# EasyEDA Pro project xxxChamp.epro

# Schematic Schematic1
Board Name: Board1; Create Date: 2025-12-23; Page Name: P1; Project Name: New Project_2025-12-23_15-30-17; Schematic Name: Schematic1; Update Date: 2025-12-23; Company: EasyEDA.com; Page Size: A4; Version: V1.0
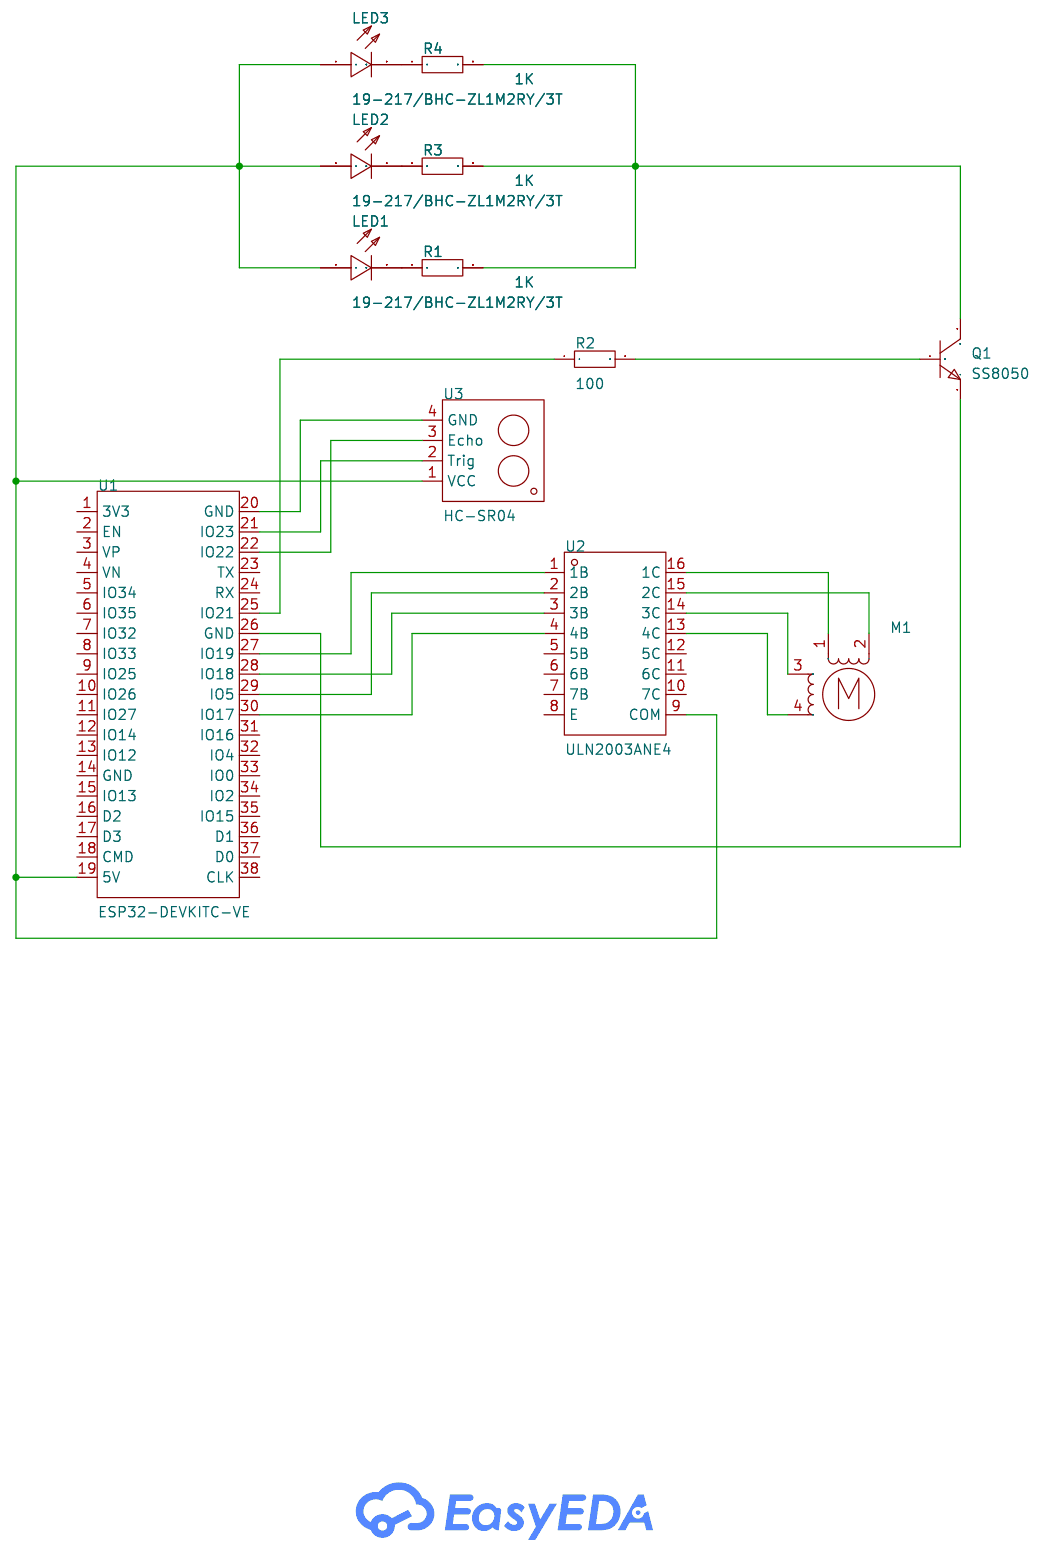
[diagram p0: schematic sheet]

## Parts
LED1  19-217/BHC-ZL1M2RY/3T
LED2  19-217/BHC-ZL1M2RY/3T
LED3  19-217/BHC-ZL1M2RY/3T
M1  Stepper_Motor_bipolar
Q1  SS8050  [SOT-23-3_L2.9-W1.3-P1.90-LS2.4-BR]
R1  1K  [R0603]
R2  100  [R0603]
R3  1K  [R0603]
R4  1K  [R0603]
U1  ESP32-DEVKITC-VE  [BULETM-SMD_ESP32-DEVKITC]
U2  ULN2003ANE4  [PDIP-16_L19.3-W6.4-P2.54-LS7.9-BL]
U3  HC-SR04

## Library data of the parts
LED1-LED3 = LED: Supplier: LCSC; Manufacturer: EVERLIGHT; Supplier Part: C72041; JLCPCB Part Class: Basic Part
M1 = Stepper_Motor_bipolar: User doc link: http://www.infineon.com/dgdl/Application-Note-TLE8110EE_driving_UniPolarStepperMotor_V1.1.pdf?fileId=db3a30431be39b97011be5d0aa0a00b0
Q1 = Transistor SS8050: Transistor Type: Collector-Emitter Breakdown Voltage (Vceo): Collector Current (Ic): Power Dissipation (Pd): Collector Cut-Off Current (Icbo):100nA Collector-Emitter Saturation Voltage (VCE(sat)@Ic,Ib):500mV@800mA,80mA DC Current Gain (hFE@Ic,Vce):200@100; Collector Cut-Off Current (Icbo): 100nA; Collector-Emitter Saturation Voltage (VCE(sat)@Ic,Ib): 500mV@800mA,80mA; Datasheet: https://atta.szlcsc.com/upload/public/pdf/source/20140809/1457707209319.pdf; DC Current Gain (hFE@Ic,Vce): 200@100mA,1V; JLCPCB Part Class: Basic Part; LCSC Part Name: NPN 25V 1.5A; Manufacturer: CJ(江苏长电/长晶); Operating Temperature: +150℃@(Tj); Supplier: LCSC; Supplier Footprint: SOT-23-3; Supplier Part: C2150; Transition Frequency (fT): 100MHz
R1-R4 = Res_0603: Supplier Footprint: 0603
U1 = ESP32-DEVKITC-VE: Supplier Part: C20437001; Manufacturer: ESPRESSIF(乐鑫); JLCPCB Part Class: Extended Part; Datasheet: https://item.szlcsc.com/datasheet/ESP32-DEVKITC-VE/21775466.html; Supplier: LCSC
U2 = ULN2003ANE4: Supplier Part: C2879059; Manufacturer: TI(德州仪器); Supplier Footprint: PDIP-16; JLCPCB Part Class: Extended Part; Datasheet: https://www.ti.com/cn/lit/gpn/uln2003ai; Supplier: LCSC
U3 = HC-SR04

## Nets
Net-(LED1-1): LED1.1(A) LED2.1(A) LED3.1(A) U1.19(5V) U2.9(COM) U3.1(VCC)
Net-(LED1-2): LED1.2(C) R1.1
Net-(LED2-2): LED2.2(C) R3.1
Net-(LED3-2): LED3.2(C) R4.1
Net-(M1-1): M1.1 U2.16(1C)
Net-(M1-2): M1.2(-) U2.15(2C)
Net-(M1-3): M1.3 U2.14(3C)
Net-(M1-4): M1.4 U2.13(4C)
Net-(Q1-1): Q1.1(B) R2.2
Net-(Q1-2): Q1.2(E) U1.26(GND)
Net-(Q1-3): Q1.3(C) R1.2 R3.2 R4.2
Net-(R2-1): R2.1 U1.25(IO21)
Net-(U1-20): U1.20(GND) U3.4(GND)
Net-(U1-21): U1.21(IO23) U3.2(Trig)
Net-(U1-22): U1.22(IO22) U3.3(Echo)
Net-(U1-27): U1.27(IO19) U2.1(1B)
Net-(U1-28): U1.28(IO18) U2.3(3B)
Net-(U1-29): U1.29(IO5) U2.2(2B)
Net-(U1-30): U1.30(IO17) U2.4(4B)

Not connected (* = marked no-connect by the designer): U1 1(3V3) 2(EN) 3(VP) 4(VN) 5(IO34) 6(IO35) 7(IO32) 8(IO33) 9(IO25) 10(IO26) 11(IO27) 12(IO14) 13(IO12) 14(GND) 15(IO13) 16(D2) 17(D3) 18(CMD) 23(TX) 24(RX) 31(IO16) 32(IO4) 33(IO0) 34(IO2) 35(IO15) 36(D1) 37(D0) 38(CLK); U2 5(5B) 6(6B) 7(7B) 8(E) 10(7C) 11(6C) 12(5C)
